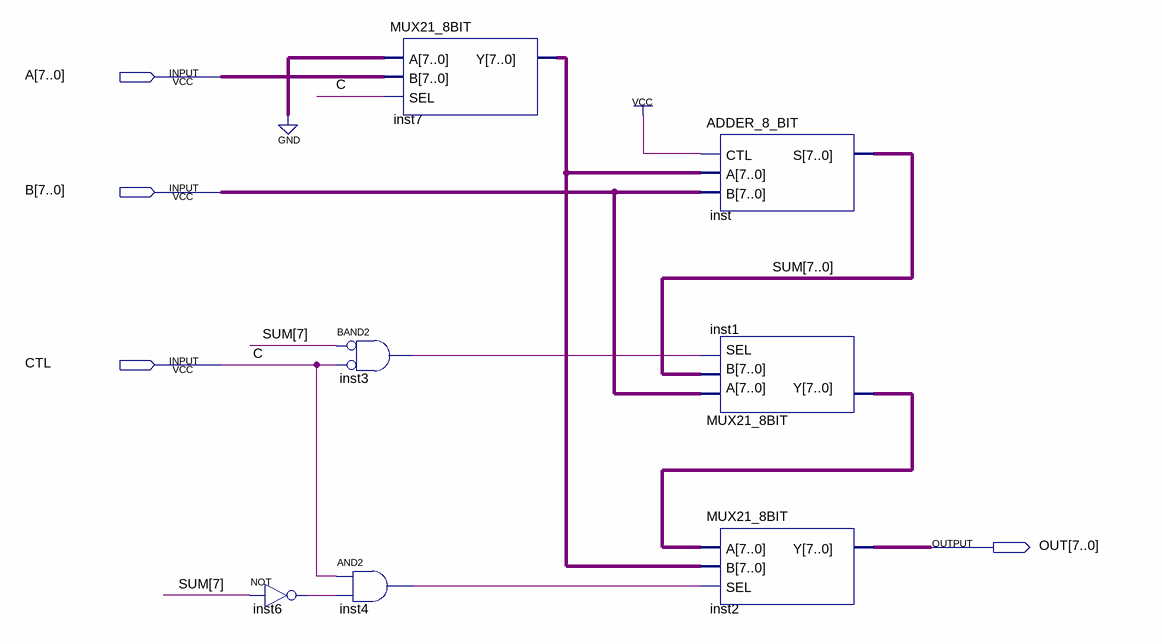
[diagram p0: schematic sheet]
// Quartus schematic ABS_MAX.bdf as structural Verilog: 7 symbols, 4 pins
module ABS_MAX (
  input  [7:0] A,
  input  [7:0] B,
  input  CTL,
  output [7:0] OUT
);

  wire inst3_out, inst4_out, inst6_out;
  wire [7:0] inst1_y, inst7_y, SUM;

  not inst6 (inst6_out, SUM[7]);
  MUX21_8BIT inst7 (.A({8{1'b0}}), .B(A), .SEL(CTL), .Y(inst7_y));
  and inst3 (inst3_out, ~SUM[7], ~CTL);  // BAND2
  and inst4 (inst4_out, CTL, inst6_out);
  ADDER_8_BIT inst (.CTL(1'b1), .A(inst7_y), .B(B), .S(SUM));
  MUX21_8BIT inst1 (.A(B), .B(SUM), .SEL(inst3_out), .Y(inst1_y));
  MUX21_8BIT inst2 (.A(inst1_y), .B(inst7_y), .SEL(inst4_out), .Y(OUT));

  // Other names for the same wires on the sheet: C = CTL
endmodule
